# Altium schematic sheet Sayma_mezz_top.SchDoc: =ProjectName
size 420 x 297 mm; Author: SBH; CompanyName: WUT; DrawnBy: SBH; Organization: ISE-WUT; Address1: Warsaw Univeristy of Technology; Address2: Nowowiejska 15/19; Revision: -; SheetNumber: -; SheetTotal: -; EDA_Number: ARTIQ; Projet: Sayma_Mezzanine; ModifiedBy: -; CreateDate: XX/XX/XXXX; CheckedDate: -; Title2: Sayma_mezz_top.SchDoc; DivGrp: ISE; Designer: SBH; ModifiedDate: -; ProjectName: Sayma_Mezzanine
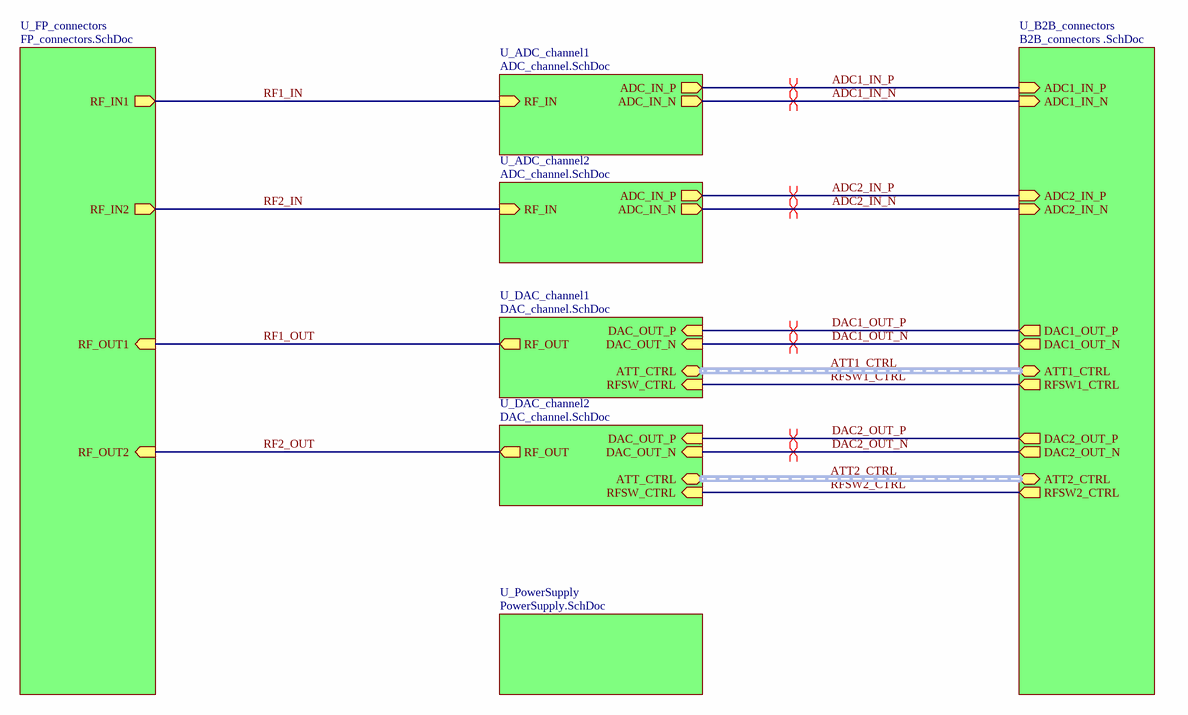
[diagram p0: Sayma_mezz_top.SchDoc]

## Sub-sheets
U_ADC_channel1 = ADC_channel.SchDoc: ADC_IN_N (out), ADC_IN_P (out), RF_IN (in)
U_ADC_channel2 = ADC_channel.SchDoc: ADC_IN_P (out), ADC_IN_N (out), RF_IN (in)
U_B2B_connectors = B2B_connectors .SchDoc: ADC1_IN_N (in), ADC1_IN_P (in), DAC1_OUT_N (out), DAC1_OUT_P (out), DAC2_OUT_N (out), DAC2_OUT_P (out), ADC2_IN_N (in), ADC2_IN_P (in), ATT1_CTRL (harness ATT_CTRL), ATT2_CTRL (harness ATT_CTRL), RFSW1_CTRL (out), RFSW2_CTRL (out)
U_DAC_channel1 = DAC_channel.SchDoc: DAC_OUT_P (in), DAC_OUT_N (in), RF_OUT (out), ATT_CTRL (harness ATT_CTRL), RFSW_CTRL (in)
U_DAC_channel2 = DAC_channel.SchDoc: DAC_OUT_P (in), DAC_OUT_N (in), RF_OUT (out), RFSW_CTRL (in), ATT_CTRL (harness ATT_CTRL)
U_FP_connectors = FP_connectors.SchDoc: RF_IN1 (out), RF_IN2 (out), RF_OUT1 (in), RF_OUT2 (in)
U_PowerSupply = PowerSupply.SchDoc: no entries

## Nets
ADC1_IN_N: sheet U_ADC_channel1/ADC_IN_N, sheet U_B2B_connectors/ADC1_IN_N
ADC1_IN_P: sheet U_ADC_channel1/ADC_IN_P, sheet U_B2B_connectors/ADC1_IN_P
ADC2_IN_N: sheet U_ADC_channel2/ADC_IN_N, sheet U_B2B_connectors/ADC2_IN_N
ADC2_IN_P: sheet U_ADC_channel2/ADC_IN_P, sheet U_B2B_connectors/ADC2_IN_P
DAC1_OUT_N: sheet U_DAC_channel1/DAC_OUT_N, sheet U_B2B_connectors/DAC1_OUT_N
DAC1_OUT_P: sheet U_DAC_channel1/DAC_OUT_P, sheet U_B2B_connectors/DAC1_OUT_P
DAC2_OUT_N: sheet U_DAC_channel2/DAC_OUT_N, sheet U_B2B_connectors/DAC2_OUT_N
DAC2_OUT_P: sheet U_DAC_channel2/DAC_OUT_P, sheet U_B2B_connectors/DAC2_OUT_P
RF1_IN: sheet U_ADC_channel1/RF_IN, sheet U_FP_connectors/RF_IN1
RF1_OUT: sheet U_DAC_channel1/RF_OUT, sheet U_FP_connectors/RF_OUT1
RF2_IN: sheet U_ADC_channel2/RF_IN, sheet U_FP_connectors/RF_IN2
RF2_OUT: sheet U_DAC_channel2/RF_OUT, sheet U_FP_connectors/RF_OUT2
RFSW1_CTRL: sheet U_DAC_channel1/RFSW_CTRL, sheet U_B2B_connectors/RFSW1_CTRL
RFSW2_CTRL: sheet U_DAC_channel2/RFSW_CTRL, sheet U_B2B_connectors/RFSW2_CTRL

## Buses and harness runs
harness ATT1_CTRL = sheet U_B2B_connectors/ATT1_CTRL = sheet U_DAC_channel1/ATT_CTRL
harness ATT2_CTRL = sheet U_B2B_connectors/ATT2_CTRL = sheet U_DAC_channel2/ATT_CTRL

## Layout directives
differential pair: ADC1_IN_N, ADC1_IN_P, ADC2_IN_N, ADC2_IN_P, DAC1_OUT_N, DAC1_OUT_P, DAC2_OUT_N, DAC2_OUT_P

## Notes on the sheet
- Project/Equipment
- Designer
- Drawn by
- Check.by
- File
- Last Mod.
- Print Date
- Sheet
- Size
- A3
- of
- Rev